# EasyEDA schematic SCH_BMS_2023-06-01.json
TITLE: Sheet_1; REV: 1.0; Date: 2023-05-29; Sheet: 1/1; Company: Your Company
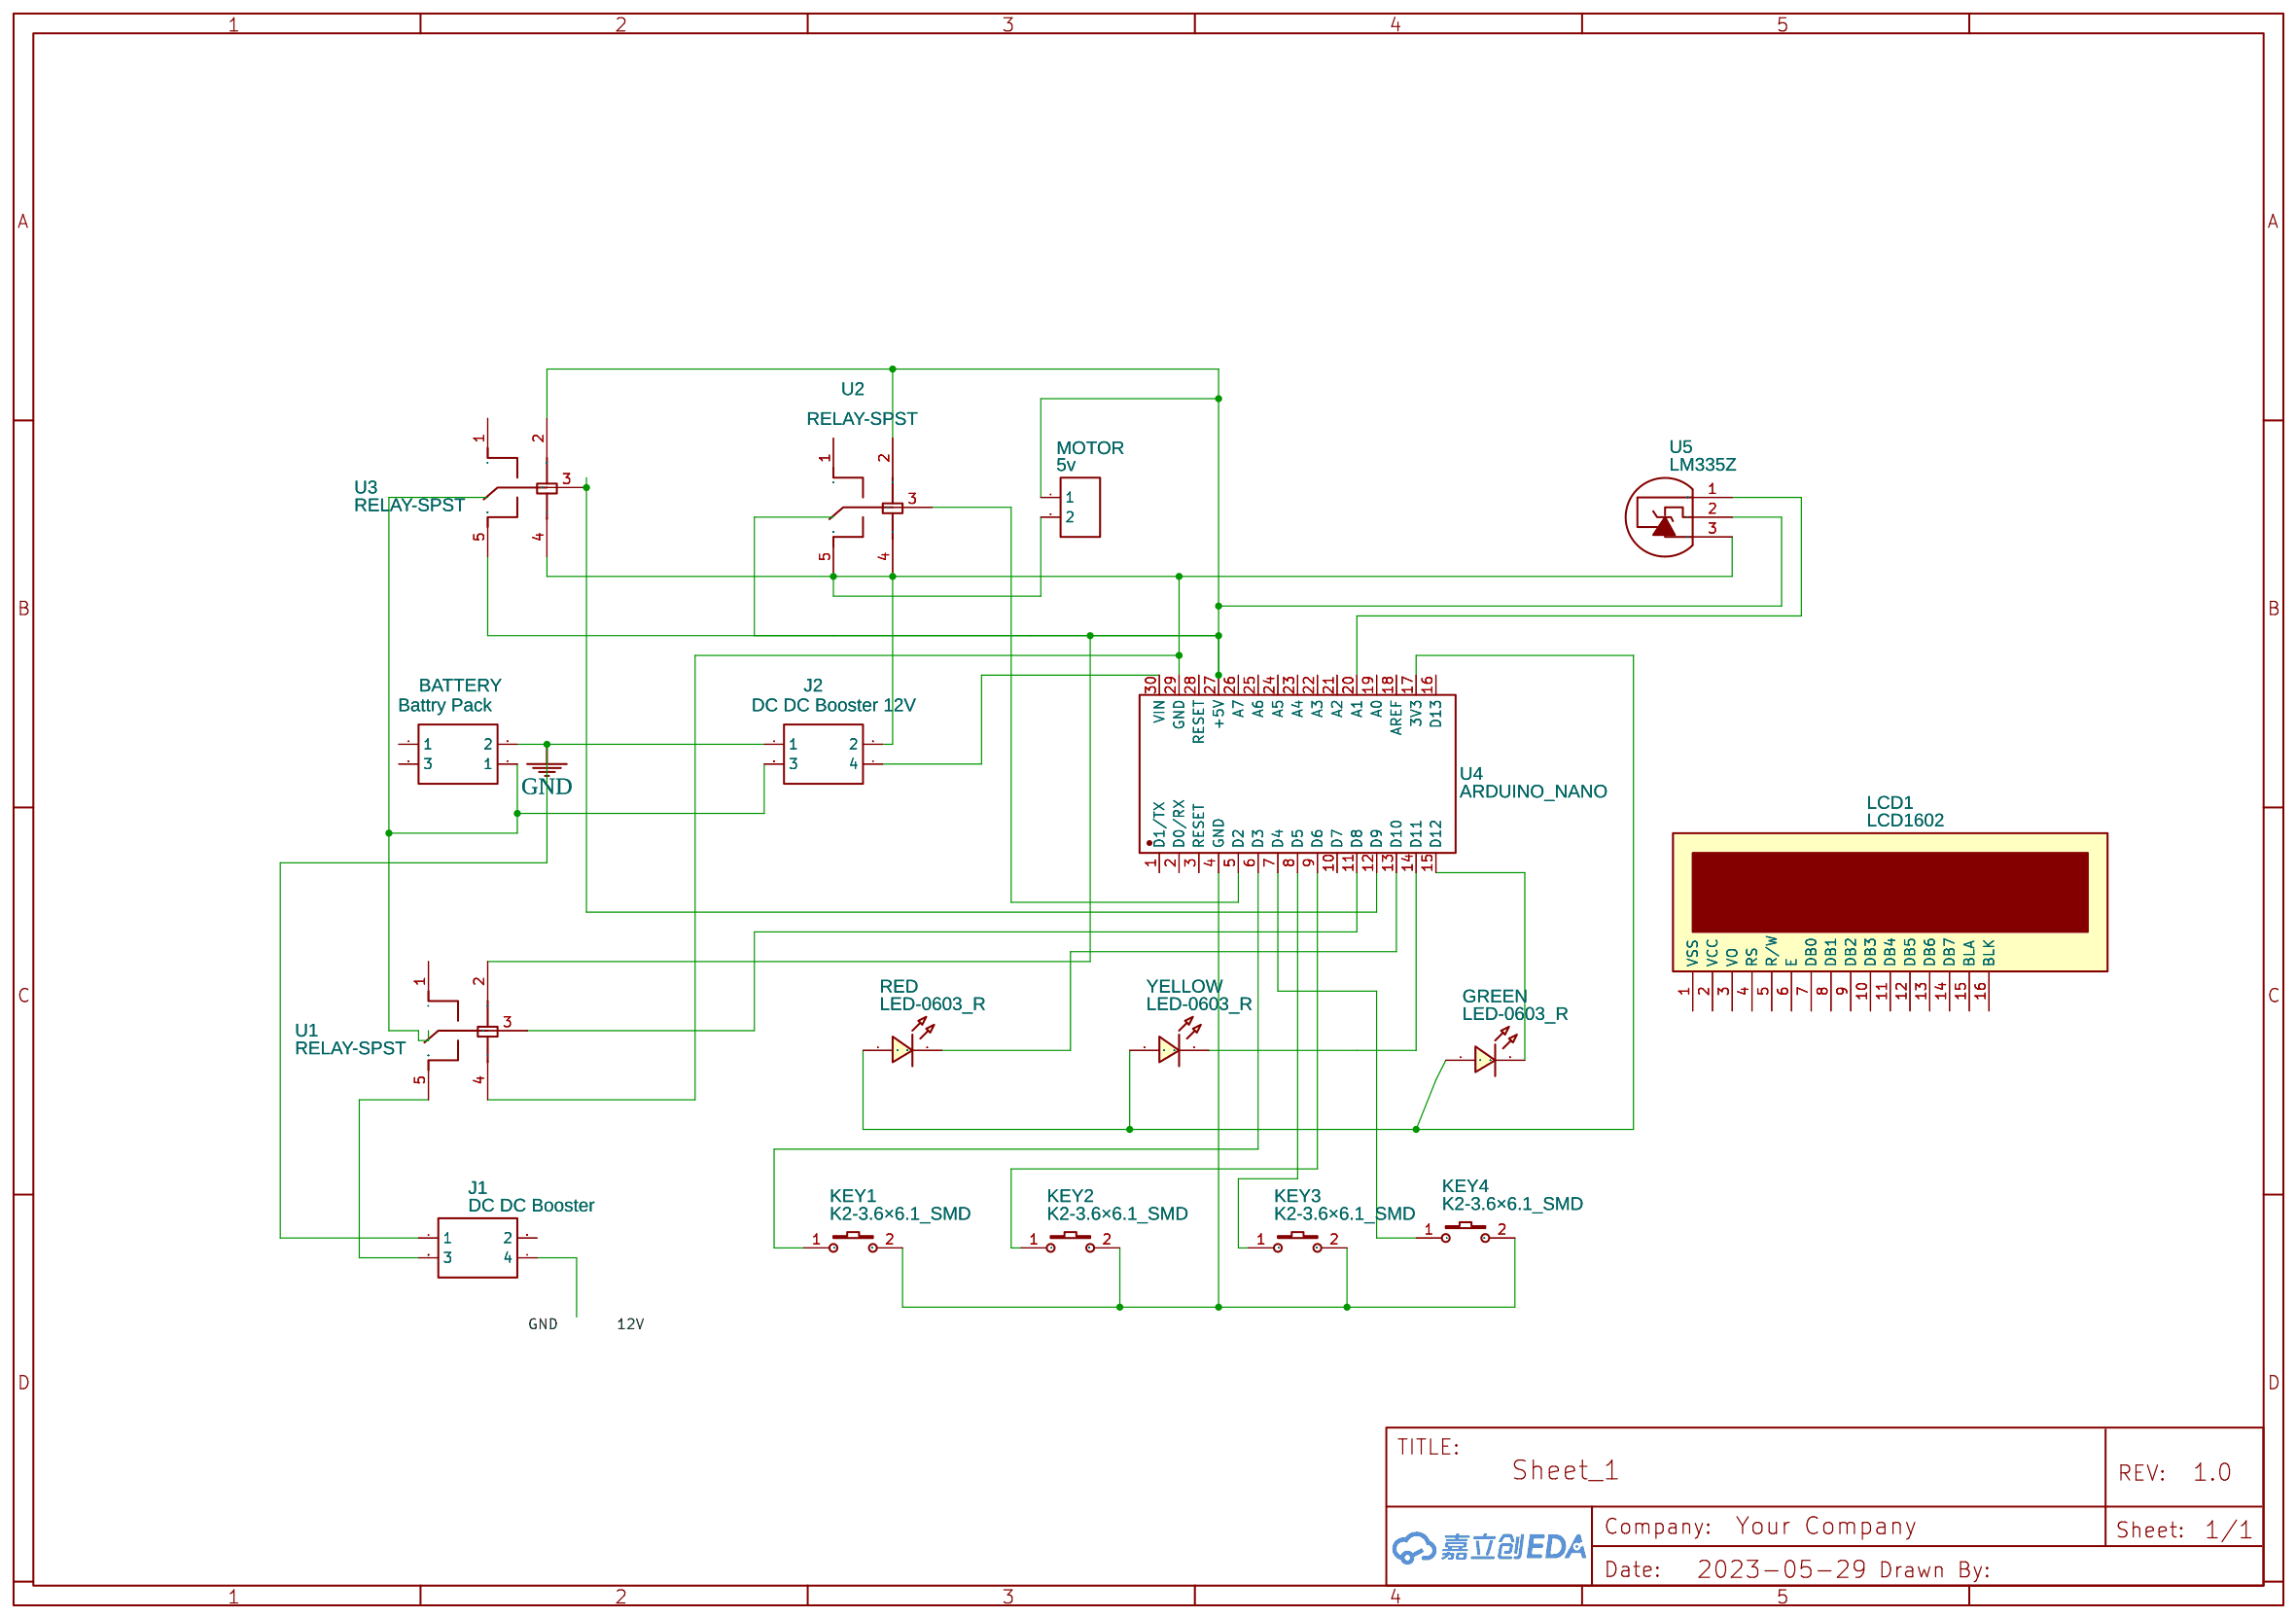
[diagram p0: schematic sheet]

## Parts
BATTERY  Battry Pack  [HDR-F-2.54_2X2]
GREEN  LED-0603_R  [LED0603_RED]
J1  DC DC Booster  [HDR-M-2.54_2X2]
J2  DC DC Booster 12V  [HDR-M-2.54_2X2]
KEY1  K2-3.6×6.1_SMD  [KEY-SMD_2P-L6.2-W3.6-LS8.0]
KEY2  K2-3.6×6.1_SMD  [KEY-SMD_2P-L6.2-W3.6-LS8.0]
KEY3  K2-3.6×6.1_SMD  [KEY-SMD_2P-L6.2-W3.6-LS8.0]
KEY4  K2-3.6×6.1_SMD  [KEY-SMD_2P-L6.2-W3.6-LS8.0]
LCD1  LCD1602  [LCD1602]
MOTOR  5v  [HDR-F-2.54_1X2]
RED  LED-0603_R  [LED0603_RED]
U1  RELAY-SPST  [RELAY-TH_RELAY-SPST]
U2  RELAY-SPST  [RELAY-TH_RELAY-SPST]
U3  RELAY-SPST  [RELAY-TH_RELAY-SPST]
U4  ARDUINO_NANO  [COMM-TH_ARDUINO_NANO]
U5  LM335Z  [TO-92-3_L4.9-W3.7-P1.27-L]
YELLOW  LED-0603_R  [LED0603_RED]

## Library data of the parts
BATTERY = HDR-F-2.54_2x2: Supplier Part: C239342; Supplier: LCSC; Contributor: LCEDA_Lib
GREEN RED YELLOW = LED-0603_R: Manufacturer: EVERLIGHT(台湾亿光); Manufacturer Part: 19-217/R6C-AL1M2VY/3T; Supplier Part: C72044; Supplier: LCSC; Contributor: LCEDA_01
J1 J2 = HDR-M-2.54_2x2: Supplier Part: C66690; Supplier: LCSC; Contributor: LCEDA_Lib
KEY1-KEY4 = K2-3.6×6.1_SMD: Supplier Part: C118141; Supplier: LCSC; Manufacturer Part: K2-1107ST-A4SW-06; Contributor: LCEDA_Lib; 制造商: 韩国韩荣
LCD1 = LCD1602: Manufacturer: LONTECH(厦门龙特); Manufacturer Part: LCM1602K-NSW-BBW; Supplier Part: C83275; Supplier: LCSC; Contributor: LCEDA_Lib
MOTOR = HDR-F-2.54_1x2: Supplier Part: C49661; Supplier: LCSC; Contributor: LCEDA_Lib
U1-U3 = RELAY-SPST: Supplier: LCSC; Supplier Part: C2941249; Manufacturer: null; Manufacturer Part: Relay-SPST; JLCPCB Part Class: Extended Part; Contributor: LCSC
U4 = ARDUINO_NANO: Supplier: LCSC; Supplier Part: C9900017879; Manufacturer: null; JLCPCB Part Class: Extended Part; Contributor: lcsc
U5 = LM335Z: Supplier: LCSC; Manufacturer: ST(意法半导体); Supplier Part: C10629; JLCPCB Part Class: Extended Part

## Nets
GND: BATTERY.2 J1.1 J2.1
Net-(BATTERY-1): BATTERY.1 J2.3
Net-(GREEN-1): GREEN.1 RED.1 U4.17(3V3) YELLOW.1
Net-(GREEN-2): GREEN.2 U4.15(D12)
Net-(J1-3): J1.3 U1.5
Net-(J2-2): J2.2 MOTOR.2 U1.4 U2.4 U2.5 U3.4 U4.29(GND) U5.3(V-)
Net-(J2-4): J2.4 U4.30(VIN)
Net-(KEY1-1): KEY1.1 U4.6(D3)
Net-(KEY1-2): KEY1.2 KEY2.2 KEY3.2 KEY4.2 U4.4(GND)
Net-(KEY2-1): KEY2.1 U4.9(D6)
Net-(KEY3-1): KEY3.1 U4.8(D5)
Net-(KEY4-1): KEY4.1 U4.7(D4)
Net-(MOTOR-1): MOTOR.1 U1.2 U2.2 U3.2 U3.5 U4.27(+5V) U5.2(V+)
Net-(RED-2): RED.2 U4.13(D10)
Net-(U1-3): U1.3 U4.11(D8)
Net-(U2-3): U2.3 U4.5(D2)
Net-(U3-3): U3.3 U4.12(D9)
Net-(U4-14): U4.14(D11) YELLOW.2
Net-(U4-20): U4.20(A1) U5.1(ADJ)

Not connected (* = marked no-connect by the designer): BATTERY 3; J1 2 4; LCD1 1(VSS) 2(VCC) 3(VO) 4(RS) 5(R/W) 6(E) 7(DB0) 8(DB1) 9(DB2) 10(DB3) 11(DB4) 12(DB5) 13(DB6) 14(DB7) 15(BLA) 16(BLK); U1 1; U2 1; U3 1; U4 1(D1/TX) 2(D0/RX) 3(RESET) 10(D7) 16(D13) 18(AREF) 19(A0) 21(A2) 22(A3) 23(A4) 24(A5) 25(A6) 26(A7) 28(RESET)
